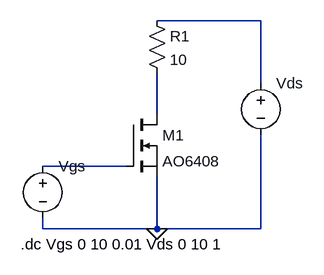
[diagram p0: schematic MOS_transfer_character.asc]
MOS_transfer_character.asc, the LTspice schematic file:
Version 4
SHEET 1 880 680
WIRE 448 0 288 0
WIRE 448 96 448 0
WIRE 288 144 288 80
WIRE 240 224 112 224
WIRE 112 320 112 304
WIRE 288 320 288 240
WIRE 288 320 112 320
WIRE 448 320 448 176
WIRE 448 320 288 320
FLAG 288 320 0
SYMBOL nmos 240 144 R0
SYMATTR InstName M1
SYMATTR Value AO6408
SYMBOL voltage 448 80 R0
WINDOW 123 0 0 Left 2
WINDOW 39 0 0 Left 2
SYMATTR InstName Vds
SYMATTR Value ""
SYMBOL voltage 112 208 R0
WINDOW 123 0 0 Left 2
WINDOW 39 0 0 Left 2
SYMATTR InstName Vgs
SYMATTR Value ""
SYMBOL res 272 -16 R0
SYMATTR InstName R1
SYMATTR Value 10
TEXT 78 344 Left 2 !.dc Vgs 0 10 0.01 Vds 0 10 1

The netlist it stands for:
* MOS_transfer_character.asc
M1 N002 N003 0 0 AO6408
Vds N001 0
Vgs N003 0
R1 N001 N002 10
.model NMOS NMOS
.model PMOS PMOS
.lib standard.mos
.dc Vgs 0 10 0.01 Vds 0 10 1
.backanno
.end